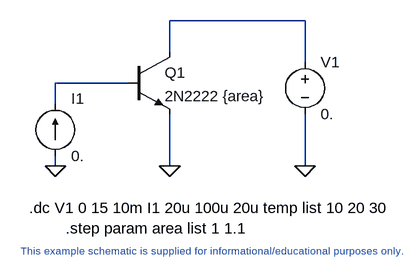
[diagram p0: schematic curvetrace2.asc]
curvetrace2.asc, the LTspice schematic file:
Version 4
SHEET 1 2580 1536
WIRE 2192 1152 1984 1152
WIRE 1984 1200 1984 1152
WIRE 2192 1216 2192 1152
WIRE 1920 1248 1808 1248
WIRE 1808 1280 1808 1248
WIRE 1808 1376 1808 1360
WIRE 1984 1376 1984 1296
WIRE 2192 1376 2192 1296
FLAG 2192 1376 0
FLAG 1984 1376 0
FLAG 1808 1376 0
SYMBOL npn 1920 1200 R0
SYMATTR InstName Q1
SYMATTR Value 2N2222 {area}
SYMBOL voltage 2192 1200 R0
SYMATTR InstName V1
SYMATTR Value 0.
SYMBOL current 1808 1360 M180
WINDOW 0 24 88 Left 2
WINDOW 3 24 0 Left 2
SYMATTR InstName I1
SYMATTR Value 0.
TEXT 1768 1440 Left 2 !.dc V1 0 15 10m I1 20u 100u 20u temp list 10 20 30
TEXT 2040 1496 Top 1 ;This example schematic is supplied for informational/educational purposes only.
TEXT 1824 1472 Left 2 !.step param area list 1 1.1

The netlist it stands for:
* curvetrace2.asc
Q1 N001 N002 0 0 2N2222 {area}
V1 N001 0 0.
I1 0 N002 0.
.model NPN NPN
.model PNP PNP
.lib standard.bjt
.dc V1 0 15 10m I1 20u 100u 20u temp list 10 20 30
* This example schematic is supplied for informational/educational purposes only.
.step param area list 1 1.1
.backanno
.end